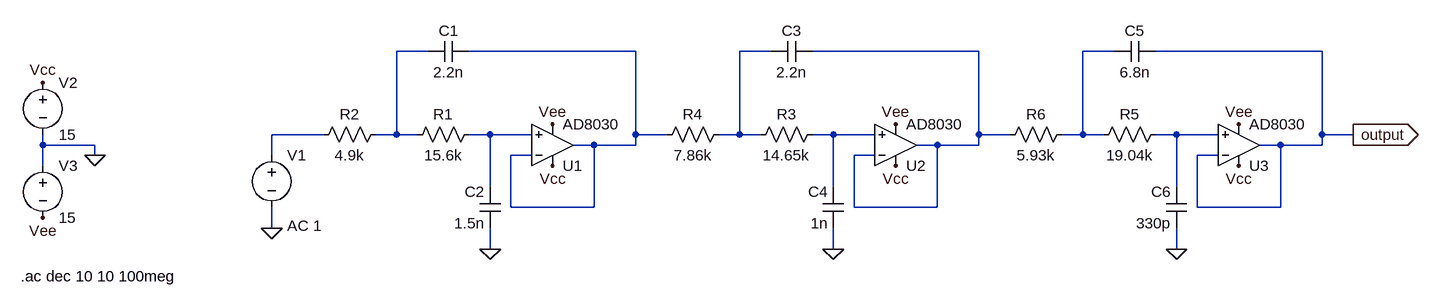
[diagram p0: schematic sallen_key_lowpass_sixth_order.asc]
sallen_key_lowpass_sixth_order.asc, the LTspice schematic file:
Version 4
SHEET 1 1512 680
WIRE -48 32 -96 32
WIRE 272 32 16 32
WIRE 480 32 432 32
WIRE 800 32 544 32
WIRE 1008 32 960 32
WIRE 1328 32 1072 32
WIRE -208 160 -288 160
WIRE -96 160 -96 32
WIRE -96 160 -128 160
WIRE -64 160 -96 160
WIRE 48 160 16 160
WIRE 112 160 48 160
WIRE 272 160 272 32
WIRE 320 160 272 160
WIRE 432 160 432 32
WIRE 432 160 400 160
WIRE 464 160 432 160
WIRE 576 160 544 160
WIRE 640 160 576 160
WIRE 800 160 800 32
WIRE 848 160 800 160
WIRE 960 160 960 32
WIRE 960 160 928 160
WIRE 992 160 960 160
WIRE 1104 160 1072 160
WIRE 1168 160 1104 160
WIRE 1328 160 1328 32
WIRE 1376 160 1328 160
WIRE -640 176 -640 160
WIRE -560 176 -640 176
WIRE 208 176 176 176
WIRE 272 176 272 160
WIRE 272 176 208 176
WIRE 736 176 704 176
WIRE 800 176 800 160
WIRE 800 176 736 176
WIRE 1264 176 1232 176
WIRE 1328 176 1328 160
WIRE 1328 176 1264 176
WIRE -560 192 -560 176
WIRE -288 192 -288 160
WIRE 112 192 80 192
WIRE 640 192 608 192
WIRE 1168 192 1136 192
WIRE -640 208 -640 176
WIRE 48 240 48 160
WIRE 576 240 576 160
WIRE 1104 240 1104 160
WIRE 80 272 80 192
WIRE 208 272 208 176
WIRE 208 272 80 272
WIRE 608 272 608 192
WIRE 736 272 736 176
WIRE 736 272 608 272
WIRE 1136 272 1136 192
WIRE 1264 272 1264 176
WIRE 1264 272 1136 272
WIRE -288 304 -288 272
WIRE 48 336 48 304
WIRE 576 336 576 304
WIRE 1104 336 1104 304
FLAG 144 208 Vcc
FLAG 144 144 Vee
FLAG 48 336 0
FLAG 672 208 Vcc
FLAG 672 144 Vee
FLAG 576 336 0
FLAG 1200 208 Vcc
FLAG 1200 144 Vee
FLAG 1104 336 0
FLAG -288 304 0
FLAG -560 192 0
FLAG -640 80 Vcc
FLAG -640 288 Vee
FLAG 1376 160 output
IOPIN 1376 160 Out
SYMBOL OpAmps\\AD8030 144 240 M180
SYMATTR InstName U1
SYMBOL res 32 144 R90
WINDOW 0 0 56 VBottom 2
WINDOW 3 32 56 VTop 2
SYMATTR InstName R1
SYMATTR Value 15.6k
SYMBOL res -112 144 R90
WINDOW 0 0 56 VBottom 2
WINDOW 3 32 56 VTop 2
SYMATTR InstName R2
SYMATTR Value 4.9k
SYMBOL cap 16 16 R90
WINDOW 0 0 32 VBottom 2
WINDOW 3 32 32 VTop 2
SYMATTR InstName C1
SYMATTR Value 2.2n
SYMBOL cap 64 304 R180
WINDOW 0 24 56 Left 2
WINDOW 3 24 8 Left 2
SYMATTR InstName C2
SYMATTR Value 1.5n
SYMBOL OpAmps\\AD8030 672 240 M180
SYMATTR InstName U2
SYMBOL res 560 144 R90
WINDOW 0 0 56 VBottom 2
WINDOW 3 32 56 VTop 2
SYMATTR InstName R3
SYMATTR Value 14.65k
SYMBOL res 416 144 R90
WINDOW 0 0 56 VBottom 2
WINDOW 3 32 56 VTop 2
SYMATTR InstName R4
SYMATTR Value 7.86k
SYMBOL cap 544 16 R90
WINDOW 0 0 32 VBottom 2
WINDOW 3 32 32 VTop 2
SYMATTR InstName C3
SYMATTR Value 2.2n
SYMBOL cap 592 304 R180
WINDOW 0 24 56 Left 2
WINDOW 3 24 8 Left 2
SYMATTR InstName C4
SYMATTR Value 1n
SYMBOL OpAmps\\AD8030 1200 240 M180
SYMATTR InstName U3
SYMBOL res 1088 144 R90
WINDOW 0 0 56 VBottom 2
WINDOW 3 32 56 VTop 2
SYMATTR InstName R5
SYMATTR Value 19.04k
SYMBOL res 944 144 R90
WINDOW 0 0 56 VBottom 2
WINDOW 3 32 56 VTop 2
SYMATTR InstName R6
SYMATTR Value 5.93k
SYMBOL cap 1072 16 R90
WINDOW 0 0 32 VBottom 2
WINDOW 3 32 32 VTop 2
SYMATTR InstName C5
SYMATTR Value 6.8n
SYMBOL cap 1120 304 R180
WINDOW 0 24 56 Left 2
WINDOW 3 24 8 Left 2
SYMATTR InstName C6
SYMATTR Value 330p
SYMBOL voltage -288 176 R0
WINDOW 123 24 124 Left 2
WINDOW 39 0 0 Left 0
SYMATTR InstName V1
SYMATTR Value ""
SYMATTR Value2 AC 1
SYMBOL voltage -640 64 R0
WINDOW 123 0 0 Left 0
WINDOW 39 0 0 Left 0
SYMATTR InstName V2
SYMATTR Value 15
SYMBOL voltage -640 192 R0
WINDOW 123 0 0 Left 0
WINDOW 39 0 0 Left 0
SYMATTR InstName V3
SYMATTR Value 15
TEXT -674 378 Left 2 !.ac dec 10 10 100meg

The netlist it stands for:
* sallen_key_lowpass_sixth_order.asc
XU1 N007 N002 Vcc Vee N002 AD8040  ; AD8030, pins In+ In- V+ V- OUT
R1 N007 N001 15.6k
R2 N001 N006 4.9k
C1 N002 N001 2.2n
C2 0 N007 1.5n
XU2 N008 N004 Vcc Vee N004 AD8040  ; AD8030, pins In+ In- V+ V- OUT
R3 N008 N003 14.65k
R4 N003 N002 7.86k
C3 N004 N003 2.2n
C4 0 N008 1n
XU3 N009 output Vcc Vee output AD8040  ; AD8030, pins In+ In- V+ V- OUT
R5 N009 N005 19.04k
R6 N005 N004 5.93k
C5 output N005 6.8n
C6 0 N009 330p
V1 N006 0 AC 1
V2 Vcc 0 15
V3 0 Vee 15
.ac dec 10 10 100meg
.lib ADI.lib
.backanno
.end